# EAGLE design briefkasten (EAGLE 6.6.0)
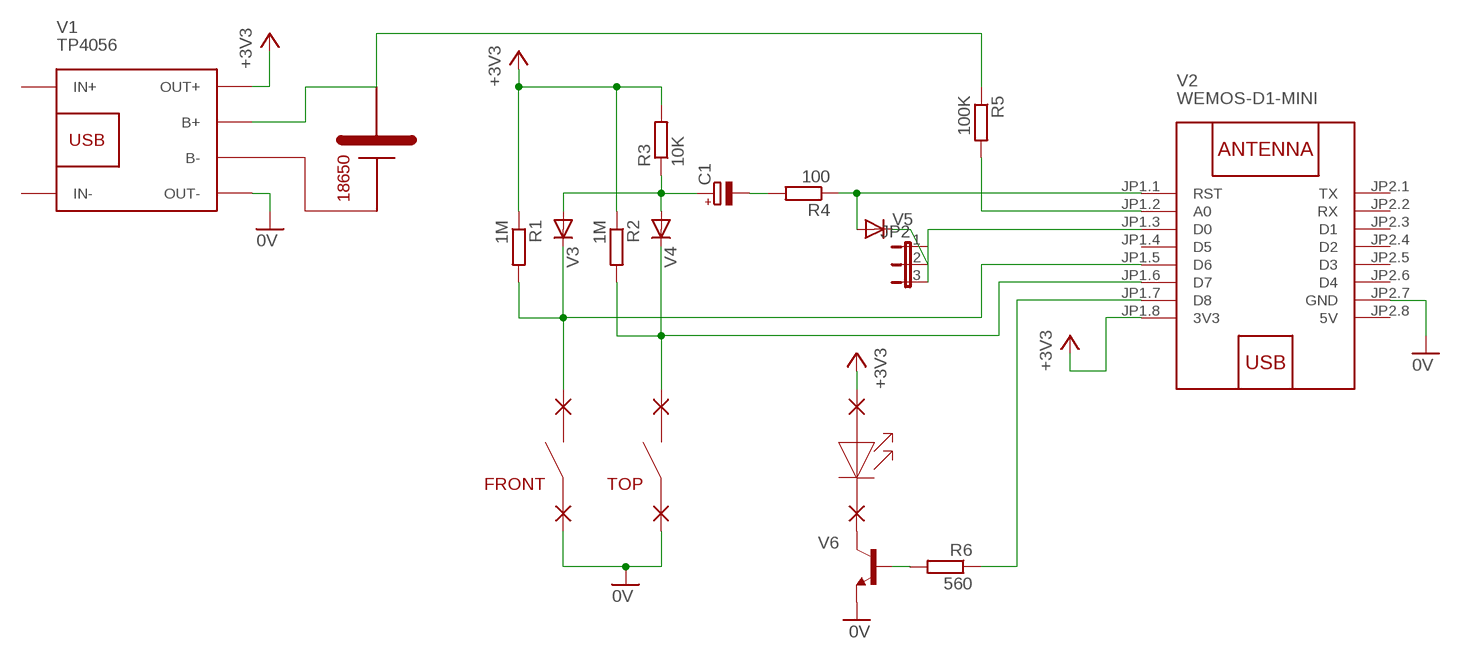
[diagram p0: schematic, sheet 1]

## Parts
C1  CPOL-EUE2.5-5  [E2,5-5]
JP2  JP2E  [JP2]
PAD7  1,6/0,9  [1,6/0,9]
PAD8  1,6/0,9  [1,6/0,9]
PAD9  1,6/0,9  [1,6/0,9]
PAD10  1,6/0,9  [1,6/0,9]
PAD11  1,6/0,9  [1,6/0,9]
PAD12  1,6/0,9  [1,6/0,9]
R1  1M  R-EU_0207/7  [0207/7]
R2  1M  R-EU_0207/7  [0207/7]
R3  10K  R-EU_0207/7  [0207/7]
R4  100  R-EU_0309/V  [0309V]
R5  100K  R-EU_0207/7  [0207/7]
R6  560  R-EU_0207/7  [0207/7]
V1  TP4056  BATTERY-CHARGER-LI-PROT  [BATTERY-CHARGER-LI-PROT]
V2  WEMOS-D1-MINI  [WEMOS-D1-MINI]
V3  1N4148DO35-7  [DO35-7]
V4  1N4148DO35-7  [DO35-7]
V5  DIODE-D-2.5  [D-2.5]
V6  -NPN-TO92-EBC  [TO92-EBC]

## Nets
0V: PAD10.1(P) PAD12.1(P) V1.OUT- V2.JP2.7(GND) V6.E
+3V3: PAD8.1(P) R1.1 R2.1 R3.2 V1.OUT+ V2.JP1.8(3V3)
N$1: PAD7.1(P) V6.C
N$2: PAD11.1(P) R2.2 V2.JP1.6(D7) V4.C
N$3: C1.- R4.2
N$5: JP2.2 V5.C
N$6: R4.1 V2.JP1.1(RST) V5.A
N$7: C1.+ R3.1 V3.A V4.A
N$8: R5.1 V1.B+
N$9: PAD9.1(P) R1.2 V2.JP1.5(D6) V3.C
N$10: R5.2 V2.JP1.2(A0)
N$11: JP2.3 V2.JP1.3(D0)
N$14: R6.1 V2.JP1.7(D8)
N$16: R6.2 V6.B
Unconnected: JP2.1 V1.B- V1.IN+ V1.IN- V2.JP1.4(D5) V2.JP2.1(TX) V2.JP2.2(RX) V2.JP2.3(D1) V2.JP2.4(D2) V2.JP2.5(D3) V2.JP2.6(D4)

## Notes on the sheet
- 18650
- FRONT | TOP

## Power pins joined to a net without a drawn wire
5V: V2.JP2.8(5V)

## Library data of the parts
C1 = resistor:CPOL-EU: POLARIZED CAPACITOR, European symbol
JP2 = jumper:JP2E: JUMPER
PAD7-PAD12 = wirepad:1,6/0,9: THROUGH-HOLE PAD
R1-R6 = resistor:R-EU_: RESISTOR, European symbol
V1 = diy-modules:BATTERY-CHARGER-LI-PROT: Lithium Battery 5V Charger with protection circuit More details available here: http://www.instructables.com/id/DIY-Lithium-ion-Battery-Charger/step4/TP4056-based-lithium-ion-battery-charger-module/ Click here to find device on ebay.com <http://www.ebay.com/sch/tp4056+charger+usb+protection>
V2 = diy-modules:WEMOS-D1-MINI: WEMOS D1 mini: Mini Wi-Fi Board based on ESP-8266 device More details can be found here: https://www.wemos.cc/product/d1-mini.html Click here to find device on ebay.com <http://www.ebay.com/sch/wemos+d1+mini+nodemcu>
V3 V4 = diode:1N4148: DIODE high speed (Philips)
V5 = diode:DIODE-: DIODE
V6 = transistor:*-NPN-: NPN Transistror BF959 corrected 2008.03.06

## Board
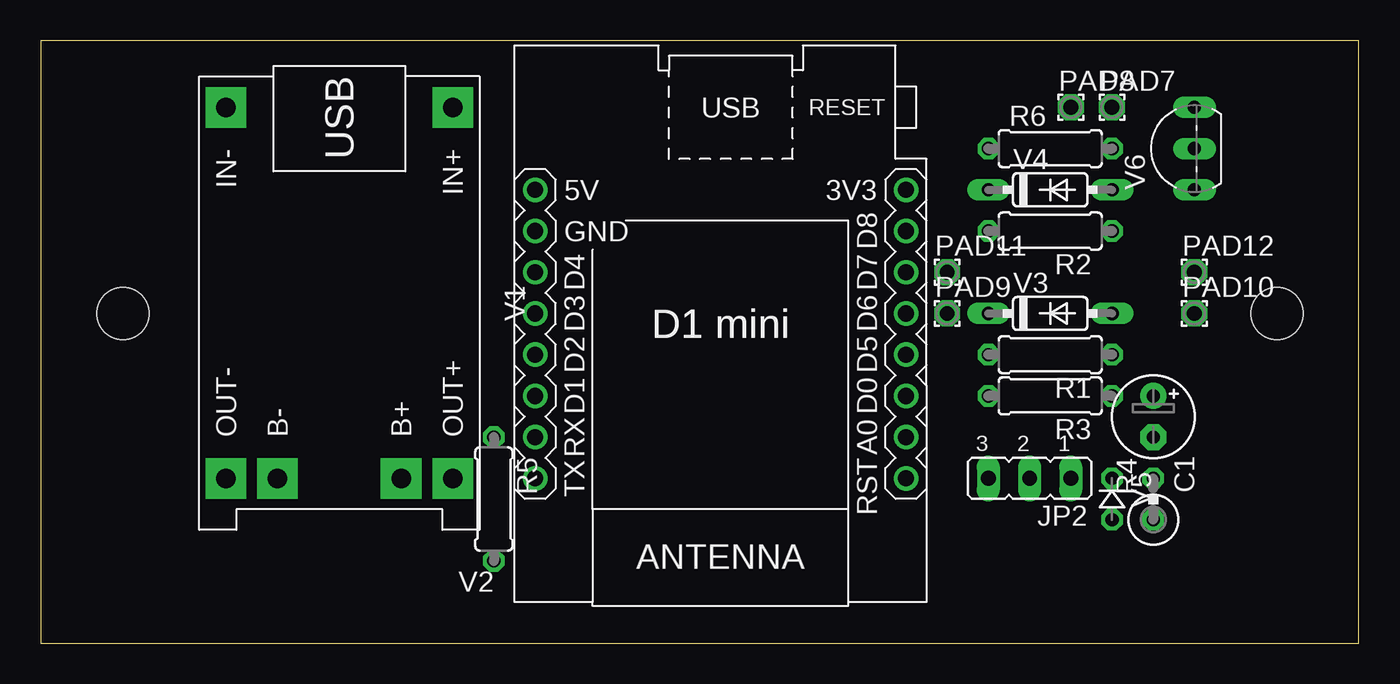
[diagram p1: board, top side]
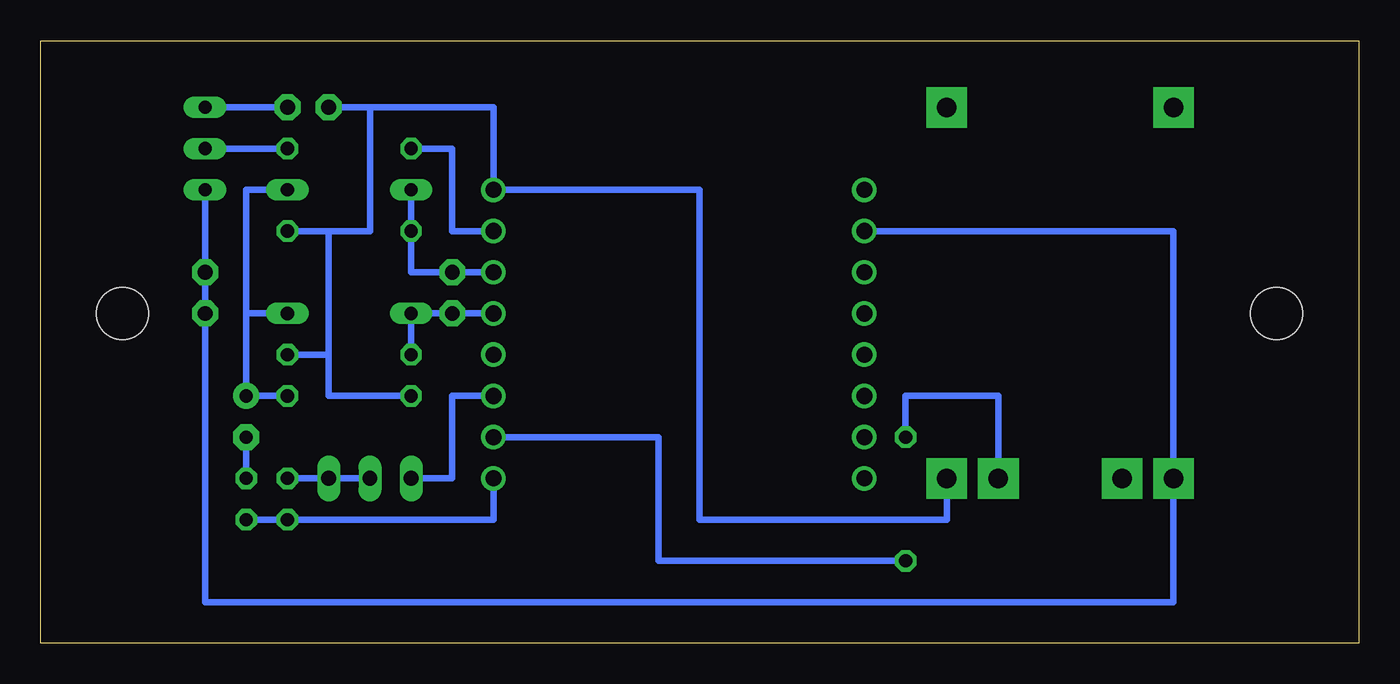
[diagram p2: board, bottom side, seen from below]

Size 81.26 x 37.13 mm. Coordinates in mm from the lower left corner, seen from the top.
Outline: 0,0 81.26,0 81.26,37.13 0,37.13 0,0
Copper layers (1*16): Top 0.035mm / dielectric 1.5mm / Bottom 0.035mm
Design rules "default": minimum track width 10mil, minimum drill 24mil, track to track 8mil, track to pad 8mil, pad to pad 8mil, via to via 8mil, smd to smd 8mil, copper to edge 40mil, drill to drill 8mil, minimum pad ring 10mil, minimum via ring 8mil, stop-mask expansion 4mil, vias tented up to drill 0mil, thermal gap 10mil
Holes 3.2 mm at 5.08,20.32 76.2,20.32
bRestrict: area 2.5,17.8 to 7.6,22.9; area 73.7,17.8 to 78.7,22.9

### Footprints (pad centres in the part's own frame; a part is rotated, then mirrored left to right if it is on the bottom)
E2,5-5 = drill 0.813 pad 1.6: + -1.27,0 | drill 0.813 pad 1.6 octagon: - 1.27,0
JP2 = drill 0.914 long: 1 -2.54,0; 2 0,0; 3 2.54,0
1,6/0,9 = drill 0.914 pad 1.6 octagon: 1 0,0
0207/7 = drill 0.813 octagon: 1 -3.81,0; 2 3.81,0
0309V = drill 0.813 octagon: 1 -1.27,0; 2 1.27,0
BATTERY-CHARGER-LI-PROT = drill 1.2 pad 2.5 square: B+ 10.795,3.81; B- 10.795,-3.81; IN+ -12.065,6.985; IN- -12.065,-6.985; OUT+ 10.795,6.985; OUT- 10.795,-6.985
WEMOS-D1-MINI = drill 1: JP1.1 -11.43,9.525; JP1.2 -11.43,6.985; JP1.3 -11.43,4.445; JP1.4 -11.43,1.905; JP1.5 -11.43,-0.635; JP1.6 -11.43,-3.175; JP1.7 -11.43,-5.715; JP1.8 -11.43,-8.255; JP2.1 11.43,9.525; JP2.2 11.43,6.985; JP2.3 11.43,4.445; JP2.4 11.43,1.905; JP2.5 11.43,-0.635; JP2.6 11.43,-3.175; JP2.7 11.43,-5.715; JP2.8 11.43,-8.255
DO35-7 = drill 0.813 long: A 3.81,0; C -3.81,0
D-2.5 = drill 0.813 octagon: A 1.27,0; C -1.27,0
TO92-EBC = drill 0.813 long: B 0,-1.27; C 2.54,-1.27; E -2.54,-1.27

### Placement (x,y rotation side)
C1  68.58,13.97 270 top
JP2  60.96,10.16 180 top
PAD7  66.04,33.02 0 top
PAD8  63.5,33.02 0 top
PAD9  55.88,20.32 0 top
PAD10  71.12,20.32 0 top
PAD11  55.88,22.86 0 top
PAD12  71.12,22.86 0 top
R1  62.23,17.78 180 top
R2  62.23,25.4 180 top
R3  62.23,15.24 180 top
R4  68.58,8.89 90 top
R5  27.94,8.89 270 top
R6  62.23,30.48 0 top
V1  18.41,20.96 270 top
V2  41.91,19.68 180 top
V3  62.23,20.32 0 top
V4  62.23,27.94 0 top
V5  66.04,8.89 270 top
V6  69.85,30.48 90 top

### Tracks (layer width: path | path; a pad name or v marks a point on that pad's centre or on a via)
0V
  Bottom 0.406: V2.JP2.7 11.43,25.4 V1.OUT- 11.43,2.54 71.12,2.54 PAD12.1 | PAD10.1 PAD12.1 | PAD12.1 V6.E
+3V3
  Bottom 0.406: 63.5,17.78 63.5,15.24 R3.2 | R1.1 63.5,17.78 | 63.5,17.78 63.5,25.4 | 63.5,25.4 R2.1 | PAD8.1 60.96,33.02 | 63.5,25.4 60.96,25.4 60.96,33.02 | 60.96,33.02 53.34,33.02 V2.JP1.8 40.64,27.94 40.64,7.62 25.4,7.62 V1.OUT+
N$1
  Bottom 0.406: PAD7.1 V6.C
N$2
  Bottom 0.406: V2.JP1.6 PAD11.1 58.42,22.86 R2.2 V4.C
N$3
  Bottom 0.406: C1.- R4.2
N$5
  Bottom 0.406: JP2.2 V5.C
N$6
  Bottom 0.406: R4.1 V5.A 53.34,7.62 V2.JP1.1
N$7
  Bottom 0.406: R3.1 C1.+ 68.58,20.32 | V3.A 68.58,20.32 | V4.A 68.58,27.94 68.58,20.32
N$8
  Bottom 0.406: V1.B+ 22.23,15.24 27.94,15.24 R5.1
N$9
  Bottom 0.406: R1.2 V3.C PAD9.1 V2.JP1.5
N$10
  Bottom 0.406: V2.JP1.2 43.18,12.7 43.18,5.08 R5.2
N$11
  Bottom 0.406: V2.JP1.3 55.88,15.24 55.88,10.16 JP2.3
N$14
  Bottom 0.406: R6.1 55.88,30.48 55.88,25.4 V2.JP1.7
N$16
  Bottom 0.406: V6.B R6.2